# Altium schematic sheet PS380_12.SchDoc: {Наименование}
size 420 x 297 mm; ApprovedBy: {Утвердил}; CheckedBy: {Проверил}; DrawnBy: {Разработал}; Engineer: {Инженер}; DocumentNumber: {Обозначение}; SheetNumber: {}; SheetTotal: {}; Scale: {Масш.}; Title1str: {Наименование}; Title2str: {Наименование}; ProcessInspection: {Т.контр.}; Mass: {Масса}; NormInspection: {Н.контр.}; EngineerName: {Инженер}; Letter1Column: {}; Letter2Column: {}; Letter3Column: {}; DocumentType: {Документ}; DocumentType1str: {Документ}; DocumentType2str: {Документ}; ImagePath: {Перв. применение}; Rule: PcbType=ProtelPcb
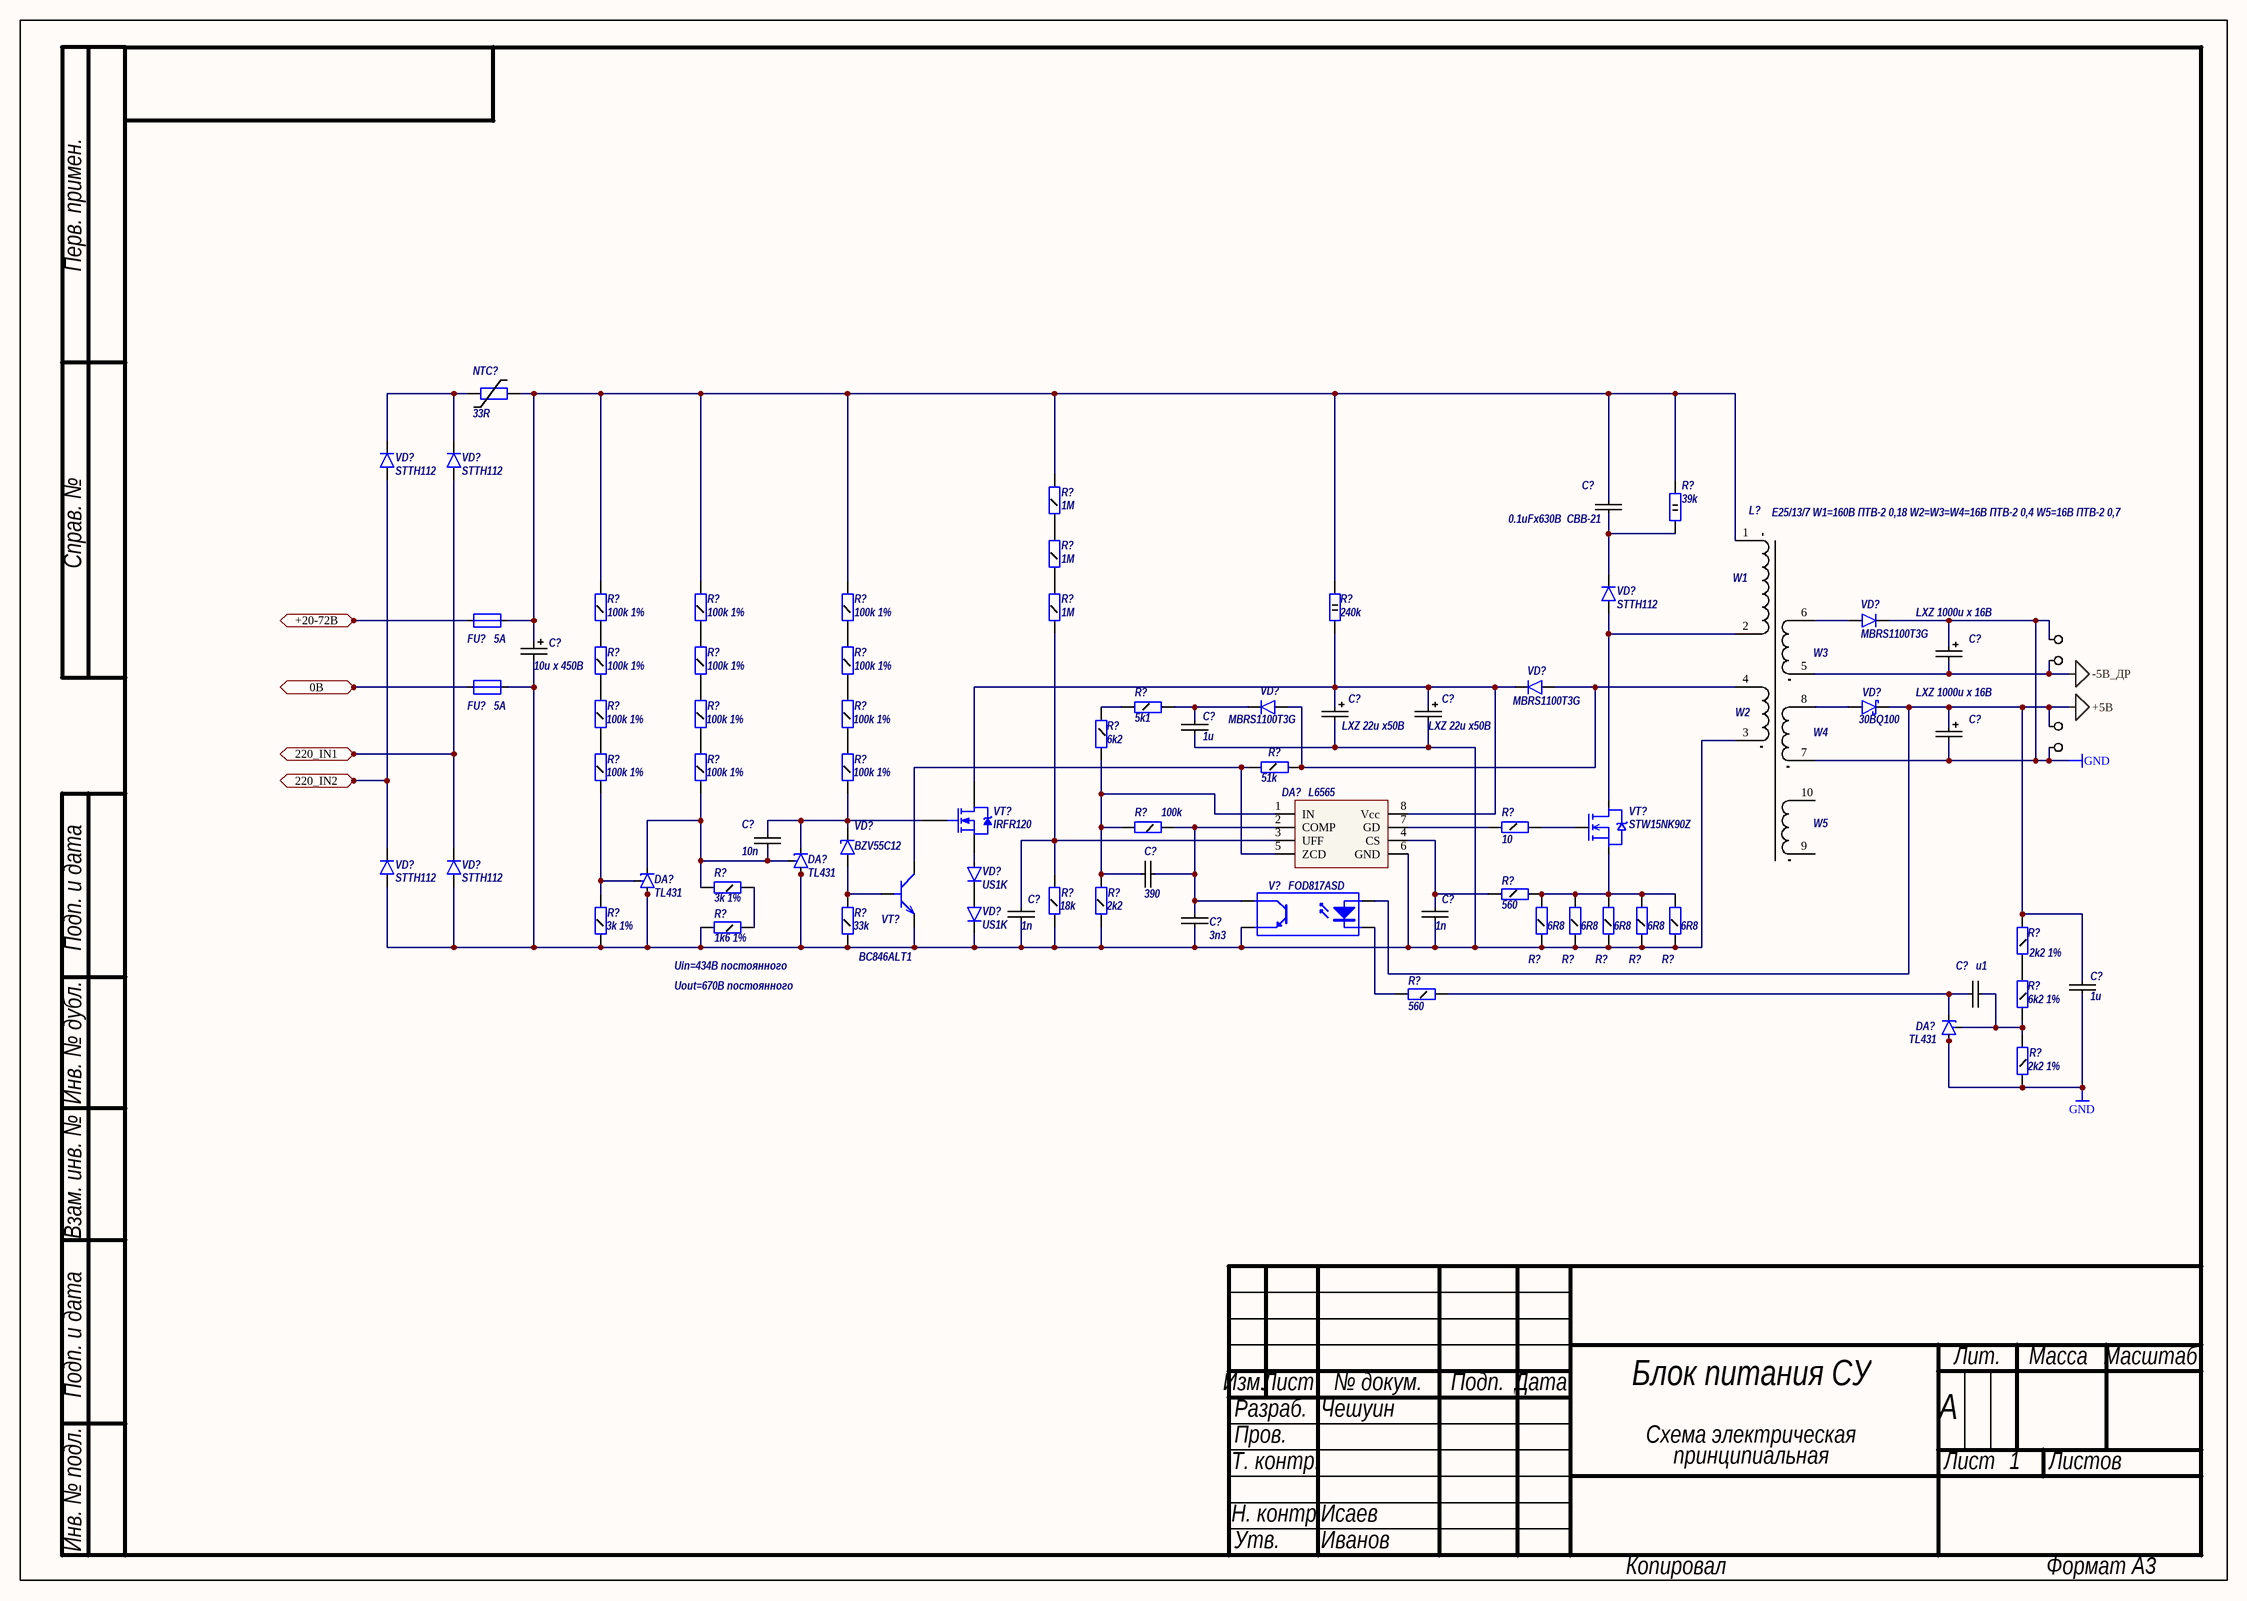
[diagram p0: PS380_12.SchDoc]

## Parts
(Parts that share a designator on the sheet are numbered #1, #2 ... from top to bottom, then left to right.)
C?#1  0.1uFx630B  CBB-21  [0.1uf *630V]
C?#2  10u x 450B  [10uf x 450V]
C?#3  LXZ 1000u x 16B  [CAP_POL_13x21]
C?#4  LXZ 22u x50B  [CAP_POL_6.3x12]
C?#5  LXZ 22u x50B  [CAP_POL_6.3x12]
C?#6  LXZ 1000u x 16B  [CAP_POL_13x21]
C?#7  1u  [_1206]
C?#8  10n  [_1206]
C?#9  390  [_1206]
C?#10  3n3  [_1206]
C?#11  1n  [_1206]
C?#12  1n  [_1206]
C?#13  u1  [_1206]
C?#14  1u  [_1206]
DA?#1  L6565  [SO-G8]
DA?#2  TL431  [SO-G8]
DA?#3  TL431  [SO-G8]
DA?#4  TL431  [SO-G8]
FU?#1  5A  [FUSE-3A]
FU?#2  5A  [FUSE-3A]
L?  E25/13/7 W1=160B ПТВ-2 0,18 W2=W3=W4=16B ПТВ-2 0,4 W5=16B ПТВ-2 0,7  [Lps_360RH]
NTC?  33R  [NTC 33R]
R?#1  1M  [_1206]
R?#2  39k  [Res 2W]
R?#3  1M  [_1206]
R?#4  100k 1%  [_1206]
R?#5  100k 1%  [_1206]
R?#6  100k 1%  [_1206]
R?#7  1M  [_1206]
R?#8  240k  [MF-2 vert]
R?#9  100k 1%  [_1206]
R?#10  100k 1%  [_1206]
R?#11  100k 1%  [_1206]
R?#12  6k2  [_1206]
R?#13  5k1  [_1206]
R?#14  100k 1%  [_1206]
R?#15  100k 1%  [_1206]
R?#16  100k 1%  [_1206]
R?#17  51k  [_1206]
R?#18  100k 1%  [_1206]
R?#19  100k 1%  [_1206]
R?#20  100k 1%  [_1206]
R?#21  100k  [_1206]
R?#22  10  [_1206]
R?#23  3k 1%  [_1206]
R?#24  560  [_1206]
R?#25  1k6 1%  [_1206]
R?#26  18k  [_1206]
R?#27  2k2  [_1206]
R?#28  3k 1%  [_1206]
R?#29  33k  [_1206]
R?#30  6R8  [_1206]
R?#31  6R8  [_1206]
R?#32  6R8  [_1206]
R?#33  6R8  [_1206]
R?#34  6R8  [_1206]
R?#35  2k2 1%  [_1206]
R?#36  560  [_1206]
R?#37  6k2 1%  [_1206]
R?#38  2k2 1%  [_1206]
V?  FOD817ASD  [FOD817ASD]
VD?#1  STTH112  [10bq*]
VD?#2  STTH112  [10bq*]
VD?#3  STTH112  [10bq*]
VD?#4  MBRS1100T3G  [10bq*]
VD?#5  MBRS1100T3G  [10bq*]
VD?#6  MBRS1100T3G  [10bq*]
VD?#7  30BQ100  [30bq*]
VD?#8  BZV55C12  [_1206D]
VD?#9  US1K  [10bq*]
VD?#10  STTH112  [10bq*]
VD?#11  STTH112  [10bq*]
VD?#12  US1K  [10bq*]
VT?#1  IRFR120  [TO-252AA]
VT?#2  STW15NK90Z  [IRFP4468_BS]
VT?#3  BC846ALT1  [SOT-23]
XP?#1  PAD  [PAD_otv]  (value not drawn)
XP?#2  PAD  [PAD_otv]  (value not drawn)
XP?#3  PAD  [PAD_otv]  (value not drawn)
XP?#4  PAD  [PAD_otv]  (value not drawn)
XP?#5  PAD  [PAD_otv]  (value not drawn)
XP?#6  PAD  [PAD_otv]  (value not drawn)
XP?#7  PAD  [PAD_otv]  (value not drawn)
XP?#8  PAD  [PAD_otv]  (value not drawn)

## Ports
0B, 220_IN1, 220_IN2, +20-72B

## Nets
+5В: C?#6.+ C?#14.1(OA) R?#35.2 V?.1(A) VD?#7.2 XP?#5.1
-5В_ДР: C?#3.- L?.5 XP?#3.1
GND: C?#3.+ C?#6.- C?#14.2(OA) DA?#4.6 DA?#4.7 L?.7 R?#38.1 VD?#4.2 XP?#2.1 XP?#6.1
0B: FU?#2.1 XP?#4.1 ; port 0B
220_IN1: VD?#2.1 VD?#11.2 XP?#7.1 ; port 220_IN1
220_IN2: VD?#1.1 VD?#10.2 XP?#8.1 ; port 220_IN2
+20-72B: FU?#1.1 XP?#1.1 ; port +20-72B
NetC?#1_1: C?#1.1(OA) C?#2.1 FU?#1.2 L?.1 NTC?.2 R?#1.2 R?#2.2 R?#4.2 R?#5.2 R?#6.2 R?#8.2
NetC?#1_2: C?#1.2(OA) R?#2.1 VD?#3.2
NetC?#2_2: C?#2.2 C?#4.- C?#5.- C?#7.2(OA) C?#10.1(OA) C?#11.2(OA) C?#12.2(OA) DA?#1.6(GND) DA?#2.6 DA?#2.7 DA?#3.6 DA?#3.7 FU?#2.2 L?.3 R?#25.2 R?#26.1 R?#27.1 R?#28.1 R?#29.1 R?#30.1 R?#31.1 R?#32.1 R?#33.1 R?#34.1 V?.3(E) VD?#10.1 VD?#11.1 VD?#12.2 VT?#3.2
NetC?#4_+: C?#4.+ C?#5.+ DA?#1.8(Vcc) R?#8.1 VD?#5.2 VT?#1.4(D)
NetC?#7_1: C?#7.1(OA) R?#13.2 VD?#6.2
NetC?#8_1: C?#8.1(OA) DA?#2.1 R?#20.1 VD?#8.2 VT?#1.1(G)
NetC?#8_2: C?#8.2(OA) DA?#2.8 DA?#3.1 R?#19.1 R?#23.2
NetC?#9_1: C?#9.1(OA) DA?#1.1(IN) R?#12.2 R?#21.2 R?#27.2
NetC?#9_2: C?#9.2(OA) C?#10.2(OA) DA?#1.2(COMP) R?#21.1 V?.4(C)
NetC?#11_1: C?#11.1(OA) DA?#1.3(UFF) R?#7.1 R?#26.2
NetC?#12_1: C?#12.1(OA) DA?#1.4(CS) R?#24.1
NetC?#13_1: C?#13.1(OA) DA?#4.1 R?#36.1
NetC?#13_2: C?#13.2(OA) DA?#4.8 R?#37.1 R?#38.2
NetDA?#1_5: DA?#1.5(ZCD) R?#17.1 VT?#3.3
NetDA?#1_7: DA?#1.7(GD) R?#22.1
NetDA?#3_8: DA?#3.8 R?#18.1 R?#28.2
NetL?_2: L?.2 VD?#3.1 VT?#2.2(drane)
NetL?_4: L?.4 R?#17.2 VD?#5.1 VD?#6.1
NetL?_6: L?.6 VD?#4.1
NetL?_8: L?.8 VD?#7.1
NetNTC?_1: NTC?.1 VD?#1.2 VD?#2.2
NetR?#1_1: R?#1.1 R?#3.2
NetR?#3_1: R?#3.1 R?#7.2
NetR?#4_1: R?#4.1 R?#9.2
NetR?#5_1: R?#5.1 R?#10.2
NetR?#6_1: R?#6.1 R?#11.2
NetR?#9_1: R?#9.1 R?#14.2
NetR?#10_1: R?#10.1 R?#15.2
NetR?#11_1: R?#11.1 R?#16.2
NetR?#12_1: R?#12.1 R?#13.1
NetR?#14_1: R?#14.1 R?#18.2
NetR?#15_1: R?#15.1 R?#19.2
NetR?#16_1: R?#16.1 R?#20.2
NetR?#22_2: R?#22.2 VT?#2.1(gate)
NetR?#23_1: R?#23.1 R?#25.1
NetR?#24_2: R?#24.2 R?#30.2 R?#31.2 R?#32.2 R?#33.2 R?#34.2 VT?#2.3(sourse)
NetR?#29_2: R?#29.2 VD?#8.1 VT?#3.1
NetR?#35_1: R?#35.1 R?#37.2
NetR?#36_2: R?#36.2 V?.2(K)
NetVD?#9_1: VD?#9.1 VT?#1.3(S)
NetVD?#9_2: VD?#9.2 VD?#12.1

Not connected (* = marked no-connect by the designer): L? 9 10

## Notes on the sheet
- Перв. примен.
- Справ. №
- Подп. и дата
- (near R?#25) Uin=434В постоянного
- Uout=670В постоянного
- Инв. № дубл.
- Взам. инв. №
- Изм.
- Лист
- № докум.
- Подп.
- Дата
- Блок питания СУ
- Лит.
- Масса
- Масштаб
- Т. контр.
- Пров.
- Разраб.
- Чешуин
- Схема электрическая
- принципиальная
- А
- 1
- Листов
- Инв. № подл.
- Н. контр.
- Исаев
- Утв.
- Иванов
- Копировал
- Формат А3
- (in symbol Lps_360RH) W1; W3; W2; W4; W5

## Library data of the parts
C?#1 = Capacitor: ManufacturerPartNumber: 0.1мкФ±20% 250В; SType: -250В; Docum: ОЖО.461.104 ТУ; Type1: К73-17; Tolerance: 20%; Value: 0.1uFx630B  CBB-21; Feature: Конденсатор
C?#2 = 10мкФ х 450В: Power: 450В; Value: 10u x 450B; Feature: Конденсатор
C?#3 C?#6 = 1000 мкФ х 25В: Tolerance: -20 +80%; Type1: Nippon Chemi-Con; SType: -LXY-25B; Value: 1000u; Feature: Конденсатор; Dopvalue: 1000 мкФ х 25В
C?#4 C?#5 = CAP_POL: ManufacturerPartNumber: 22мкФ±20% 50В KMF; SType: -50В; Docum: Nippon Chemi-Con; Type1: EKY; Tolerance: 20%; Value: LXZ 22u x50B; Feature: Конденсатор
C?#7 C?#9-C?#14 = Capacitor: Type1: C1206; Tolerance: 10%; SType: -X7R-50B; Docum: PHYCOMP; Pins: 2; Feature: Конденсатор; Package: 1206
  C?#7 C?#14: Value: 1u
  C?#9: Value: 390
  C?#10: Value: 3n3
  C?#11 C?#12: Value: 1n
  C?#13: Value: u1
C?#8 = Capacitor: ManufacturerPartNumber: CC1206 1мкФ±10% 50В X7R; SType: -X7R-50В; Tolerance: 10%; Body: 1206; Docum: PHYCOMP; Type1: C1206; Value: 10n; Feature: Конденсатор; Package: 1206
DA?#1 = L6565: Docum: ST Microelectronics; Feature: Микросхема
DA?#2 DA?#3 = TL431: Docum: Texas Instruments; Body: SO-8; Feature: Микросхема; Type1: TL431; ManufacturerPartNumber: TL431; Package: SO-8
DA?#4 = TL431: Docum: Texas Instruments; Feature: Микросхема
FU?#1 FU?#2 = FUSE: VValue: 5A; Feature: Предохранитель; Value: 5A
L? = Lps_360RH: Индуктивность
NTC? = NTC 33R: Позистор; Feature: Позистор
R?#1 R?#3-R?#6 R?#9-R?#11 R?#17 R?#22 R?#24 R?#30-R?#34 = R1206: Tolerance: 5%; Docum: Bourns; Feature: Резистор; Type1: R1206
  R?#1 R?#3: Value: 1M
  R?#4-R?#6 R?#9-R?#11: Value: 100k 1%
  R?#17: Value: 51k
  R?#22: Value: 10
  R?#24: Value: 560
  R?#30-R?#34: Value: 6R8
R?#2 = Res 2W: Value: 100k
R?#7 R?#12 R?#13 R?#21 R?#26 R?#27 R?#29 R?#36 = R1206: Tolerance: 1%; Docum: Bourns; Feature: Резистор; Type1: R1206
  R?#7: Value: 1M
  R?#12: Value: 6k2
  R?#13: Value: 5k1
  R?#21: Value: 100k
  R?#26: Value: 18k
  R?#27: Value: 2k2
  R?#29: Value: 33k
  R?#36: Value: 560
R?#8 = Res 2W: Power/Voltage: 2; Tolerance: 10%; Docum: Hitano; Type1: MF-2; Value: 240k; Feature: Резистор; VValue: 240k
R?#14-R?#16 R?#18-R?#20 R?#25 R?#35 R?#37 R?#38 = R1206: Docum: Bourns; Feature: Резистор; Tolerance: 1%; Type1: R1206
  R?#14-R?#16 R?#18-R?#20: Value: 100k 1%
  R?#25: Value: 1k6
  R?#35: Value: 2k2
  R?#37: Value: 6k2 1%
  R?#38: Value: 2k2 1%
R?#23 R?#28 = R1206: Value: 1k6; Docum: Bourns; Feature: Резистор; Tolerance: 1%; Type1: R1206
V? = FOD817ASD: Docum: Fairchild Semiconductor; Feature: Оптопара; Type1: FOD817ASD
VD?#1-VD?#3 VD?#10 VD?#11 = DIOD_2: ManufacturerPartNumber: STTH2R060U; Docum: ST Microelectronics; Body: SMB; Feature: Диод; Type1: STTH112; Package: SMB
VD?#4-VD?#6 VD?#9 VD?#12 = DIOD_1: Docum: ON Semiconductor; Feature: Диод
  VD?#4-VD?#6: Type1: MBRS1100T3G
  VD?#9 VD?#12: Type1: US1K
VD?#7 = DIOD_SH: Docum: International Rectifier; Body: SMC; Feature: Диод; Type1: 30BQ100; ManufacturerPartNumber: 30BQ100; Package: SMC
VD?#8 = DIOD_ZN: Zener Diode; ManufacturerPartNumber: BZV55C9V1; Docum: Generic Components; Body: CD1206; Revision: July-2002: Re-released for DXP Platform.; Feature: Диод; Type1: BZV55C12; Package: CD1206
VT?#1 = IRLR110: HEXFET N-Channel Power MOSFET; Note: Pin 2 is trimmed and is electrically connected to Drain.; Docum: International Rectifier; Type1: IRLR3410; Body: DPAK; Published: 8-Jun-2000; LatestRevisionDate: 17-Jul-2002; LatestRevisionNote: Re-released for DXP Platform.; DatasheetVersion: PD-9.633A; PackageVersion: Feb-2003; PackageReference: TO-252AA; PackageDescription: D-PAK/TO-252-AA; 3 Leads (1 Cropped); Body 10.4 (inc. leads) x 6.7 mm (LxW max); ComponentLink1Description: Manufacturer Link; ComponentLink1URL: http://www.irf.com/; ComponentLink2Description: Datasheet; ComponentLink2URL: http://www.irf.com/product-info/datasheets/data/irlr110.pdf; Feature: Транзистор; ManufacturerPartNumber: IRLR3410; Package: DPAK
VT?#2 = irfp4468_otv: Manufacturer: International Rectifier; Body: TO-247AC; Value: IRFP4468; Feature: Транзистор; Manufacturer Number: IRFP4468
VT?#3 = TRANS_npn: Docum: ON Semiconductor; Feature: Транзистор; Type1: BC846ALT1; Body: SOT-23; ManufacturerPartNumber: BC846ALT1; Package: SOT-23